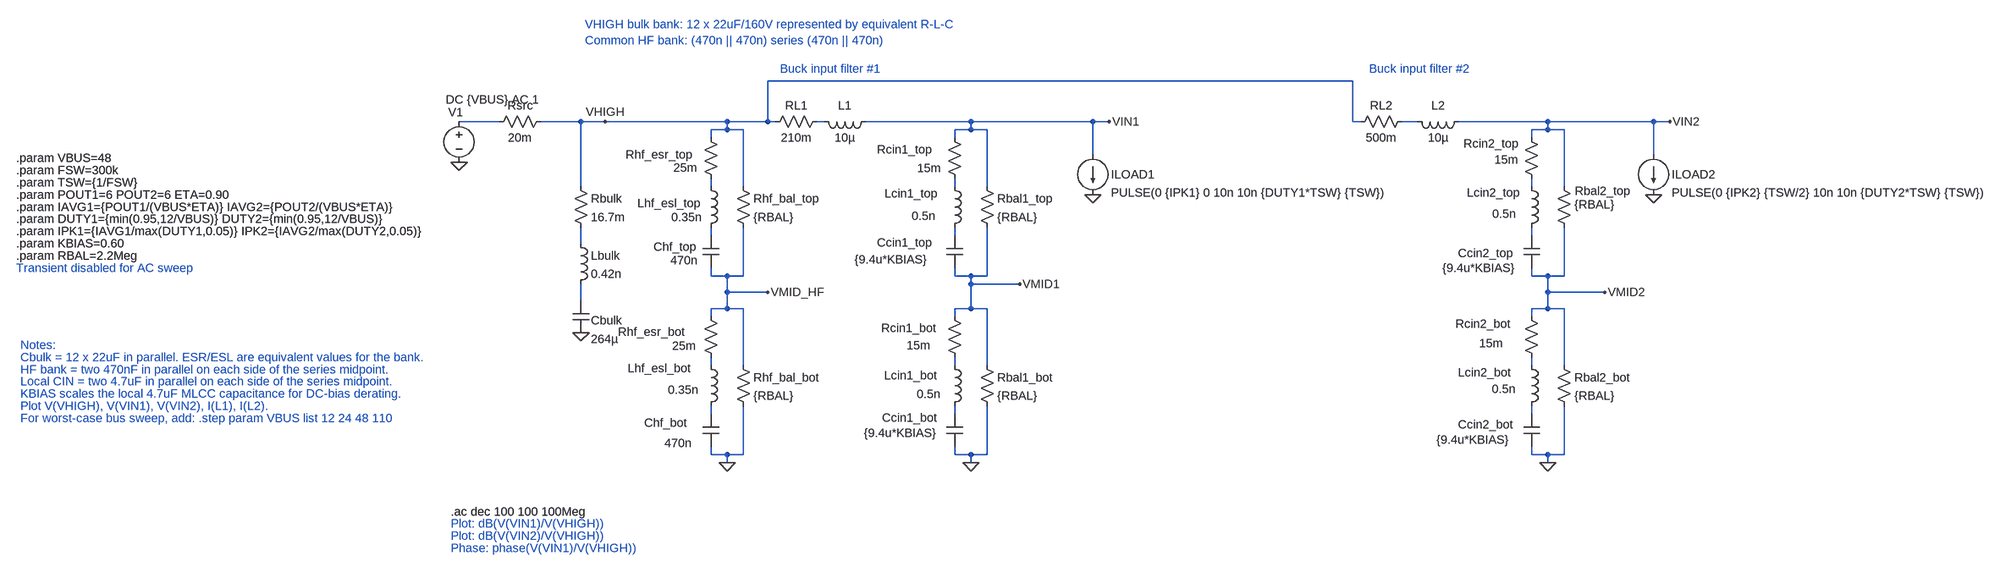
[diagram p0: schematic lm5169_dual_pi_filter_selfcontained_AC.asc]
lm5169_dual_pi_filter_selfcontained_AC.asc, the LTspice schematic file:
Version 4
SHEET 1 3180 1156
WIRE 1856 16 704 16
WIRE 176 96 96 96
WIRE 336 96 256 96
WIRE 384 96 336 96
WIRE 624 96 384 96
WIRE 704 96 704 16
WIRE 704 96 624 96
WIRE 720 96 704 96
WIRE 816 96 800 96
WIRE 1104 96 896 96
WIRE 1344 96 1104 96
WIRE 1376 96 1344 96
WIRE 1856 96 1856 16
WIRE 1872 96 1856 96
WIRE 1984 96 1952 96
WIRE 2240 96 2064 96
WIRE 2448 96 2240 96
WIRE 2480 96 2448 96
WIRE 624 112 624 96
WIRE 624 112 592 112
WIRE 656 112 624 112
WIRE 1104 112 1104 96
WIRE 1104 112 1072 112
WIRE 1136 112 1104 112
WIRE 2240 112 2240 96
WIRE 2240 112 2208 112
WIRE 2272 112 2240 112
WIRE 592 128 592 112
WIRE 1072 128 1072 112
WIRE 2208 128 2208 112
WIRE 1344 160 1344 96
WIRE 2448 160 2448 96
WIRE 336 224 336 96
WIRE 592 224 592 208
WIRE 656 224 656 112
WIRE 1072 224 1072 208
WIRE 1136 224 1136 112
WIRE 2208 224 2208 208
WIRE 2272 224 2272 112
WIRE 592 320 592 304
WIRE 1072 320 1072 304
WIRE 2208 320 2208 304
WIRE 336 336 336 304
WIRE 592 400 592 384
WIRE 624 400 592 400
WIRE 656 400 656 304
WIRE 656 400 624 400
WIRE 1072 400 1072 384
WIRE 1104 400 1072 400
WIRE 1136 400 1136 304
WIRE 1136 400 1104 400
WIRE 2208 400 2208 384
WIRE 2240 400 2208 400
WIRE 2272 400 2272 304
WIRE 2272 400 2240 400
WIRE 1104 416 1104 400
WIRE 1200 416 1104 416
WIRE 624 432 624 400
WIRE 704 432 624 432
WIRE 2240 432 2240 400
WIRE 2352 432 2240 432
WIRE 336 448 336 416
WIRE 624 464 624 432
WIRE 624 464 592 464
WIRE 656 464 624 464
WIRE 1104 464 1104 416
WIRE 1104 464 1072 464
WIRE 1136 464 1104 464
WIRE 2240 464 2240 432
WIRE 2240 464 2208 464
WIRE 2272 464 2240 464
WIRE 592 480 592 464
WIRE 1072 480 1072 464
WIRE 2208 480 2208 464
WIRE 592 576 592 560
WIRE 656 576 656 464
WIRE 1072 576 1072 560
WIRE 1136 576 1136 464
WIRE 2208 576 2208 560
WIRE 2272 576 2272 464
WIRE 592 672 592 656
WIRE 1072 672 1072 656
WIRE 2208 672 2208 656
WIRE 592 752 592 736
WIRE 624 752 592 752
WIRE 656 752 656 656
WIRE 656 752 624 752
WIRE 1072 752 1072 736
WIRE 1104 752 1072 752
WIRE 1136 752 1136 656
WIRE 1136 752 1104 752
WIRE 2208 752 2208 736
WIRE 2240 752 2208 752
WIRE 2272 752 2272 656
WIRE 2272 752 2240 752
WIRE 624 768 624 752
WIRE 1104 768 1104 752
WIRE 2240 768 2240 752
FLAG 96 176 0
FLAG 384 96 VHIGH
FLAG 1376 96 VIN1
FLAG 2480 96 VIN2
FLAG 336 512 0
FLAG 704 432 VMID_HF
FLAG 624 768 0
FLAG 1200 416 VMID1
FLAG 1104 768 0
FLAG 1344 240 0
FLAG 2240 768 0
FLAG 2352 432 VMID2
FLAG 2448 240 0
SYMBOL voltage 96 80 R0
WINDOW 3 -26 -27 Left 2
WINDOW 0 -21 -2 Left 2
SYMATTR Value DC {VBUS} AC 1
SYMATTR InstName V1
SYMBOL res 272 80 R90
WINDOW 0 0 56 VBottom 2
WINDOW 3 32 56 VTop 2
SYMATTR InstName Rsrc
SYMATTR Value 20m
SYMBOL res 320 208 R0
SYMATTR InstName Rbulk
SYMATTR Value 16.7m
SYMBOL ind 320 320 R0
WINDOW 3 36 76 Left 2
SYMATTR Value 0.42n
SYMATTR InstName Lbulk
SYMBOL cap 320 448 R0
WINDOW 0 36 40 Left 2
WINDOW 3 36 76 Left 2
SYMATTR InstName Cbulk
SYMATTR Value 264µ
SYMBOL res 576 112 R0
WINDOW 0 -152 49 Left 2
WINDOW 3 -58 75 Left 2
SYMATTR InstName Rhf_esr_top
SYMATTR Value 25m
SYMBOL ind 576 208 R0
WINDOW 0 -129 49 Left 2
WINDOW 3 -62 76 Left 2
SYMATTR InstName Lhf_esl_top
SYMATTR Value 0.35n
SYMBOL cap 576 320 R0
WINDOW 0 -97 23 Left 2
WINDOW 3 -64 49 Left 2
SYMATTR InstName Chf_top
SYMATTR Value 470n
SYMBOL res 576 464 R0
WINDOW 0 -167 46 Left 2
WINDOW 3 -60 74 Left 2
SYMATTR InstName Rhf_esr_bot
SYMATTR Value 25m
SYMBOL ind 576 560 R0
WINDOW 0 -148 22 Left 2
WINDOW 3 -69 64 Left 2
SYMATTR InstName Lhf_esl_bot
SYMATTR Value 0.35n
SYMBOL cap 576 672 R0
WINDOW 0 -115 17 Left 2
WINDOW 3 -75 57 Left 2
SYMATTR InstName Chf_bot
SYMATTR Value 470n
SYMBOL res 640 208 R0
SYMATTR InstName Rhf_bal_top
SYMATTR Value {RBAL}
SYMBOL res 640 560 R0
SYMATTR InstName Rhf_bal_bot
SYMATTR Value {RBAL}
SYMBOL res 816 80 R90
WINDOW 0 0 56 VBottom 2
WINDOW 3 32 56 VTop 2
SYMATTR InstName RL1
SYMATTR Value 210m
SYMBOL ind 912 80 R90
WINDOW 0 0 56 VBottom 2
WINDOW 3 32 56 VTop 2
SYMATTR InstName L1
SYMATTR Value 10µ
SYMBOL res 1056 112 R0
WINDOW 0 -137 39 Left 2
WINDOW 3 -58 76 Left 2
SYMATTR InstName Rcin1_top
SYMATTR Value 15m
SYMBOL ind 1056 208 R0
WINDOW 0 -122 30 Left 2
WINDOW 3 -69 74 Left 2
SYMATTR InstName Lcin1_top
SYMATTR Value 0.5n
SYMBOL cap 1056 320 R0
WINDOW 0 -137 14 Left 2
WINDOW 3 -181 48 Left 2
SYMATTR InstName Ccin1_top
SYMATTR Value {9.4u*KBIAS}
SYMBOL res 1056 464 R0
WINDOW 0 -129 39 Left 2
WINDOW 3 -79 73 Left 2
SYMATTR InstName Rcin1_bot
SYMATTR Value 15m
SYMBOL ind 1056 560 R0
WINDOW 0 -123 36 Left 2
WINDOW 3 -59 73 Left 2
SYMATTR InstName Lcin1_bot
SYMATTR Value 0.5n
SYMBOL cap 1056 672 R0
WINDOW 0 -127 7 Left 2
WINDOW 3 -163 37 Left 2
SYMATTR InstName Ccin1_bot
SYMATTR Value {9.4u*KBIAS}
SYMBOL res 1120 208 R0
SYMATTR InstName Rbal1_top
SYMATTR Value {RBAL}
SYMBOL res 1120 560 R0
SYMATTR InstName Rbal1_bot
SYMATTR Value {RBAL}
SYMBOL current 1344 160 R0
WINDOW 0 36 40 Left 2
WINDOW 3 36 76 Left 2
SYMATTR InstName ILOAD1
SYMATTR Value PULSE(0 {IPK1} 0 10n 10n {DUTY1*TSW} {TSW})
SYMBOL res 1968 80 R90
WINDOW 0 0 56 VBottom 2
WINDOW 3 32 56 VTop 2
SYMATTR InstName RL2
SYMATTR Value 500m
SYMBOL ind 2080 80 R90
WINDOW 0 0 56 VBottom 2
WINDOW 3 32 56 VTop 2
SYMATTR InstName L2
SYMATTR Value 10µ
SYMBOL res 2192 112 R0
WINDOW 0 -118 27 Left 2
WINDOW 3 -57 59 Left 2
SYMATTR InstName Rcin2_top
SYMATTR Value 15m
SYMBOL ind 2192 208 R0
WINDOW 0 -111 28 Left 2
WINDOW 3 -61 70 Left 2
SYMATTR InstName Lcin2_top
SYMATTR Value 0.5n
SYMBOL cap 2192 320 R0
WINDOW 0 -129 35 Left 2
WINDOW 3 -160 64 Left 2
SYMATTR InstName Ccin2_top
SYMATTR Value {9.4u*KBIAS}
SYMBOL res 2192 464 R0
WINDOW 0 -134 30 Left 2
WINDOW 3 -87 69 Left 2
SYMATTR InstName Rcin2_bot
SYMATTR Value 15m
SYMBOL ind 2192 560 R0
WINDOW 0 -129 30 Left 2
WINDOW 3 -62 63 Left 2
SYMATTR InstName Lcin2_bot
SYMATTR Value 0.5n
SYMBOL cap 2192 672 R0
WINDOW 0 -129 21 Left 2
WINDOW 3 -171 51 Left 2
SYMATTR InstName Ccin2_bot
SYMATTR Value {9.4u*KBIAS}
SYMBOL res 2256 208 R0
WINDOW 0 37 25 Left 2
WINDOW 3 36 51 Left 2
SYMATTR InstName Rbal2_top
SYMATTR Value {RBAL}
SYMBOL res 2256 560 R0
SYMATTR InstName Rbal2_bot
SYMATTR Value {RBAL}
SYMBOL current 2448 160 R0
WINDOW 0 36 40 Left 2
WINDOW 3 36 76 Left 2
SYMATTR InstName ILOAD2
SYMATTR Value PULSE(0 {IPK2} {TSW/2} 10n 10n {DUTY2*TSW} {TSW})
TEXT -776 168 Left 2 !.param VBUS=48
TEXT -776 192 Left 2 !.param FSW=300k
TEXT -776 216 Left 2 !.param TSW={1/FSW}
TEXT -776 240 Left 2 !.param POUT1=6 POUT2=6 ETA=0.90
TEXT -776 264 Left 2 !.param IAVG1={POUT1/(VBUS*ETA)} IAVG2={POUT2/(VBUS*ETA)}
TEXT -776 288 Left 2 !.param DUTY1={min(0.95,12/VBUS)} DUTY2={min(0.95,12/VBUS)}
TEXT -776 312 Left 2 !.param IPK1={IAVG1/max(DUTY1,0.05)} IPK2={IAVG2/max(DUTY2,0.05)}
TEXT -776 336 Left 2 !.param KBIAS=0.60
TEXT -776 360 Left 2 !.param RBAL=2.2Meg
TEXT -776 384 Left 2 ;Transient disabled for AC sweep
TEXT 344 -96 Left 2 ;VHIGH bulk bank: 12 x 22uF/160V represented by equivalent R-L-C
TEXT 344 -64 Left 2 ;Common HF bank: (470n || 470n) series (470n || 470n)
TEXT 728 -8 Left 2 ;Buck input filter #1
TEXT 1888 -8 Left 2 ;Buck input filter #2
TEXT -768 536 Left 2 ;Notes:
TEXT -768 560 Left 2 ;Cbulk = 12 x 22uF in parallel. ESR/ESL are equivalent values for the bank.
TEXT -768 584 Left 2 ;HF bank = two 470nF in parallel on each side of the series midpoint.
TEXT -768 608 Left 2 ;Local CIN = two 4.7uF in parallel on each side of the series midpoint.
TEXT -768 632 Left 2 ;KBIAS scales the local 4.7uF MLCC capacitance for DC-bias derating.
TEXT -768 656 Left 2 ;Plot V(VHIGH), V(VIN1), V(VIN2), I(L1), I(L2).
TEXT -768 680 Left 2 ;For worst-case bus sweep, add: .step param VBUS list 12 24 48 110
TEXT 80 864 Left 2 !.ac dec 100 100 100Meg
TEXT 80 888 Left 2 ;Plot: dB(V(VIN1)/V(VHIGH))
TEXT 80 912 Left 2 ;Plot: dB(V(VIN2)/V(VHIGH))
TEXT 80 936 Left 2 ;Phase: phase(V(VIN1)/V(VHIGH))

The netlist it stands for:
* lm5169_dual_pi_filter_selfcontained_AC.asc
V1 N001 0 DC {VBUS} AC 1
Rsrc VHIGH N001 20m
Rbulk VHIGH N010 16.7m
Lbulk N010 N011 0.42n
Cbulk N011 0 264µ
Rhf_esr_top VHIGH N004 25m
Lhf_esl_top N004 N007 0.35n
Chf_top N007 VMID_HF 470n
Rhf_esr_bot VMID_HF N012 25m
Lhf_esl_bot N012 N015 0.35n
Chf_bot N015 0 470n
Rhf_bal_top VHIGH VMID_HF {RBAL}
Rhf_bal_bot VMID_HF 0 {RBAL}
RL1 N002 VHIGH 210m
L1 VIN1 N002 10µ
Rcin1_top VIN1 N005 15m
Lcin1_top N005 N008 0.5n
Ccin1_top N008 VMID1 {9.4u*KBIAS}
Rcin1_bot VMID1 N013 15m
Lcin1_bot N013 N016 0.5n
Ccin1_bot N016 0 {9.4u*KBIAS}
Rbal1_top VIN1 VMID1 {RBAL}
Rbal1_bot VMID1 0 {RBAL}
ILOAD1 VIN1 0 PULSE(0 {IPK1} 0 10n 10n {DUTY1*TSW} {TSW})
RL2 N003 VHIGH 500m
L2 VIN2 N003 10µ
Rcin2_top VIN2 N006 15m
Lcin2_top N006 N009 0.5n
Ccin2_top N009 VMID2 {9.4u*KBIAS}
Rcin2_bot VMID2 N014 15m
Lcin2_bot N014 N017 0.5n
Ccin2_bot N017 0 {9.4u*KBIAS}
Rbal2_top VIN2 VMID2 {RBAL}
Rbal2_bot VMID2 0 {RBAL}
ILOAD2 VIN2 0 PULSE(0 {IPK2} {TSW/2} 10n 10n {DUTY2*TSW} {TSW})
.param VBUS=48
.param FSW=300k
.param TSW={1/FSW}
.param POUT1=6 POUT2=6 ETA=0.90
.param IAVG1={POUT1/(VBUS*ETA)} IAVG2={POUT2/(VBUS*ETA)}
.param DUTY1={min(0.95,12/VBUS)} DUTY2={min(0.95,12/VBUS)}
.param IPK1={IAVG1/max(DUTY1,0.05)} IPK2={IAVG2/max(DUTY2,0.05)}
.param KBIAS=0.60
.param RBAL=2.2Meg
* Transient disabled for AC sweep
* VHIGH bulk bank: 12 x 22uF/160V represented by equivalent R-L-C
* Common HF bank: (470n || 470n) series (470n || 470n)
* Buck input filter #1
* Buck input filter #2
* Notes:
* Cbulk = 12 x 22uF in parallel. ESR/ESL are equivalent values for the bank.
* HF bank = two 470nF in parallel on each side of the series midpoint.
* Local CIN = two 4.7uF in parallel on each side of the series midpoint.
* KBIAS scales the local 4.7uF MLCC capacitance for DC-bias derating.
* Plot V(VHIGH), V(VIN1), V(VIN2), I(L1), I(L2).
* For worst-case bus sweep, add: .step param VBUS list 12 24 48 110
.ac dec 100 100 100Meg
* Plot: dB(V(VIN1)/V(VHIGH))
* Plot: dB(V(VIN2)/V(VHIGH))
* Phase: phase(V(VIN1)/V(VHIGH))
.backanno
.end